# EAGLE design mbV2 (EAGLE 5.10)
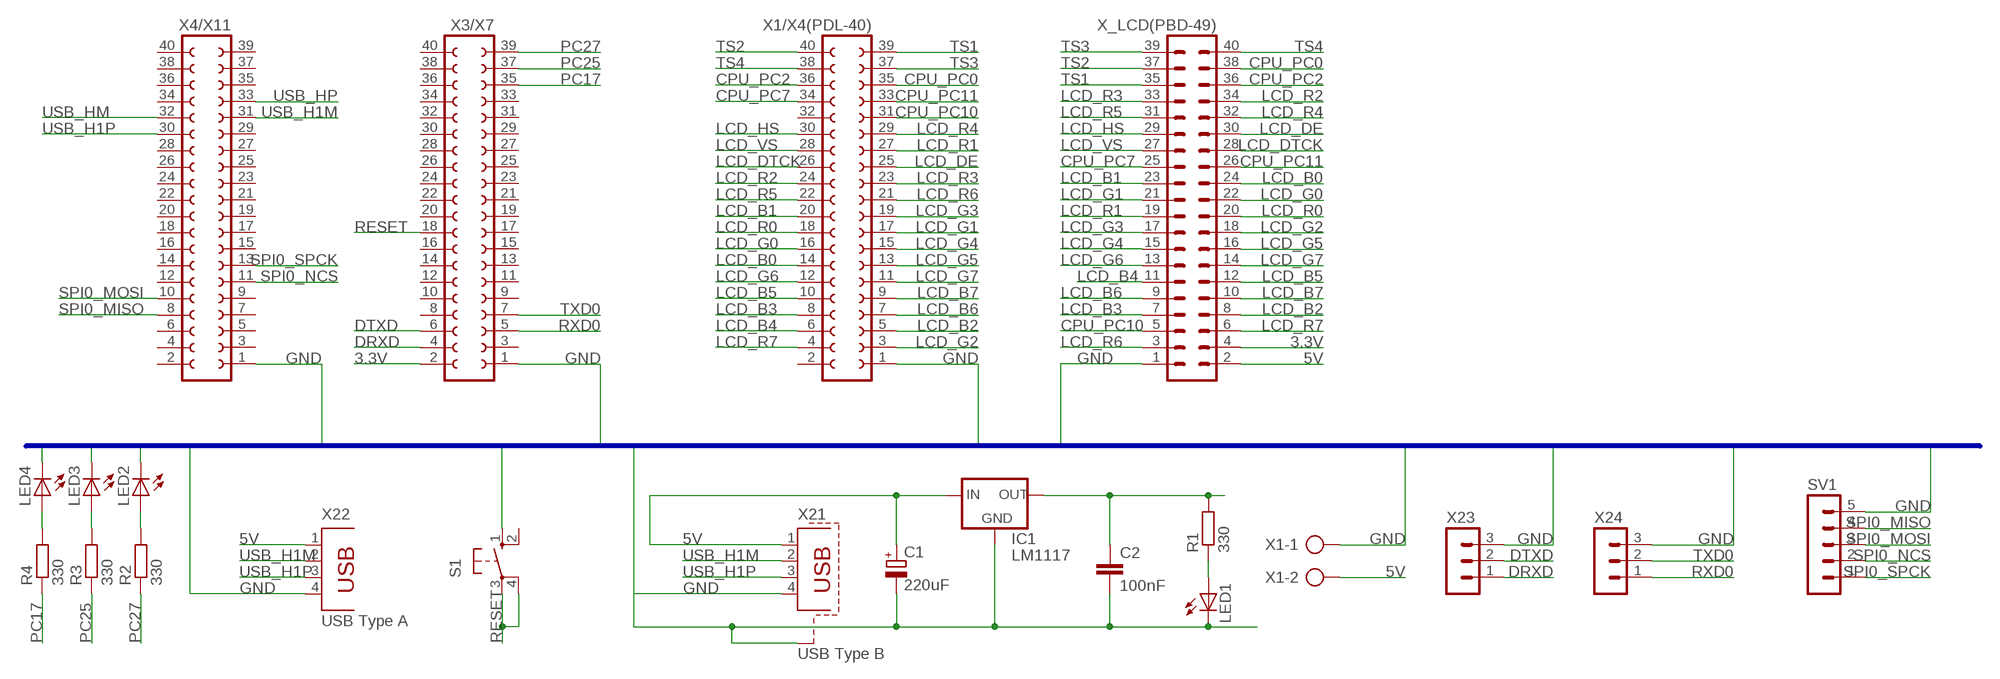
[diagram p0: schematic, sheet 1]

## Parts
C1  220uF  CPOL-EU153CLV-0605  [153CLV-0605]
C2  100nF  C-EUC1206  [C1206]
IC1  LM1117  LM1117TO252  [TO252]
LED1  LEDCHIPLED_1206  [CHIPLED_1206]
LED2  LEDCHIPLED_1206  [CHIPLED_1206]
LED3  LEDCHIPLED_1206  [CHIPLED_1206]
LED4  LEDCHIPLED_1206  [CHIPLED_1206]
R1  330  R-EU_M1206  [M1206]
R2  330  R-EU_M1206  [M1206]
R3  330  R-EU_M1206  [M1206]
R4  330  R-EU_M1206  [M1206]
S1  10-XX  [B3F-10XX]
SV1  MA05-1  [MA05-1]
X1  AK500/2  [AK500/2]
X1/X4(PDL-40)  FE20-2  [FE20-2]
X3/X7  FE20-2  [FE20-2]
X4/X11  FE20-2  [FE20-2]
X21  USB Type B  PN61729-S  [PN61729-S]
X22  USB Type A  PN87520  [PN87520]
X23  MA03-1  [MA03-1]
X24  MA03-1  [MA03-1]
X_LCD(PBD-49)  MA20-2  [MA20-2]

## Nets
3.3V: C2.1 IC1.3(OUT) R1.2 X3/X7.2 X_LCD(PBD-49).4
5V: C1.+ IC1.2(IN) X1.2 X21.1 X22.1 X_LCD(PBD-49).2
CPU_PC0: X1/X4(PDL-40).35 X_LCD(PBD-49).38
CPU_PC2: X1/X4(PDL-40).36 X_LCD(PBD-49).36
CPU_PC7: X1/X4(PDL-40).34 X_LCD(PBD-49).25
CPU_PC10: X1/X4(PDL-40).31 X_LCD(PBD-49).5
CPU_PC11: X1/X4(PDL-40).33 X_LCD(PBD-49).26
DRXD: X3/X7.4 X23.1
DTXD: X3/X7.6 X23.2
GND: C1.- C2.2 IC1.1(GND) LED1.C LED2.C LED3.C LED4.C S1.1(S) SV1.5 X1.1 X1/X4(PDL-40).1 X3/X7.1 X4/X11.1 X21.4 X21.S2 X22.4 X23.3 X24.3 X_LCD(PBD-49).1
LCD_B0: X1/X4(PDL-40).14 X_LCD(PBD-49).24
LCD_B1: X1/X4(PDL-40).20 X_LCD(PBD-49).23
LCD_B2: X1/X4(PDL-40).5 X_LCD(PBD-49).8
LCD_B3: X1/X4(PDL-40).8 X_LCD(PBD-49).7
LCD_B4: X1/X4(PDL-40).6 X_LCD(PBD-49).11
LCD_B5: X1/X4(PDL-40).10 X_LCD(PBD-49).12
LCD_B6: X1/X4(PDL-40).7 X_LCD(PBD-49).9
LCD_B7: X1/X4(PDL-40).9 X_LCD(PBD-49).10
LCD_DE: X1/X4(PDL-40).25 X_LCD(PBD-49).30
LCD_DTCK: X1/X4(PDL-40).26 X_LCD(PBD-49).28
LCD_G0: X1/X4(PDL-40).16 X_LCD(PBD-49).22
LCD_G1: X1/X4(PDL-40).17 X_LCD(PBD-49).21
LCD_G2: X1/X4(PDL-40).3 X_LCD(PBD-49).18
LCD_G3: X1/X4(PDL-40).19 X_LCD(PBD-49).17
LCD_G4: X1/X4(PDL-40).15 X_LCD(PBD-49).15
LCD_G5: X1/X4(PDL-40).13 X_LCD(PBD-49).16
LCD_G6: X1/X4(PDL-40).12 X_LCD(PBD-49).13
LCD_G7: X1/X4(PDL-40).11 X_LCD(PBD-49).14
LCD_HS: X1/X4(PDL-40).30 X_LCD(PBD-49).29
LCD_R0: X1/X4(PDL-40).18 X_LCD(PBD-49).20
LCD_R1: X1/X4(PDL-40).27 X_LCD(PBD-49).19
LCD_R2: X1/X4(PDL-40).24 X_LCD(PBD-49).34
LCD_R3: X1/X4(PDL-40).23 X_LCD(PBD-49).33
LCD_R4: X1/X4(PDL-40).29 X_LCD(PBD-49).32
LCD_R5: X1/X4(PDL-40).22 X_LCD(PBD-49).31
LCD_R6: X1/X4(PDL-40).21 X_LCD(PBD-49).3
LCD_R7: X1/X4(PDL-40).4 X_LCD(PBD-49).6
LCD_VS: X1/X4(PDL-40).28 X_LCD(PBD-49).27
N$1: LED1.A R1.1
N$4: LED2.A R2.2
N$6: LED3.A R3.2
N$7: LED4.A R4.2
PC17: R4.1 X3/X7.35
PC25: R3.1 X3/X7.37
PC27: R2.1 X3/X7.39
RESET: S1.3(P) S1.4(P1) X3/X7.18
RXD0: X3/X7.5 X24.1
SPI0_MISO: SV1.4 X4/X11.8
SPI0_MOSI: SV1.3 X4/X11.10
SPI0_NCS: SV1.2 X4/X11.11
SPI0_SPCK: SV1.1 X4/X11.13
TS1: X1/X4(PDL-40).39 X_LCD(PBD-49).35
TS2: X1/X4(PDL-40).40 X_LCD(PBD-49).37
TS3: X1/X4(PDL-40).37 X_LCD(PBD-49).39
TS4: X1/X4(PDL-40).38 X_LCD(PBD-49).40
TXD0: X3/X7.7 X24.2
USB_H1M: X4/X11.31 X21.2 X22.2
USB_H1P: X4/X11.30 X21.3 X22.3
USB_HM: X4/X11.32
USB_HP: X4/X11.33
Unconnected: S1.2(S1) X1/X4(PDL-40).2 X1/X4(PDL-40).32 X3/X7.3 X3/X7.8 X3/X7.9 X3/X7.10 X3/X7.11 X3/X7.12 X3/X7.13 X3/X7.14 X3/X7.15 X3/X7.16 X3/X7.17 X3/X7.19 X3/X7.20 X3/X7.21 X3/X7.22 X3/X7.23 X3/X7.24 X3/X7.25 X3/X7.26 X3/X7.27 X3/X7.28 X3/X7.29 X3/X7.30 X3/X7.31 X3/X7.32 X3/X7.33 X3/X7.34 X3/X7.36 X3/X7.38 X3/X7.40 X4/X11.2 X4/X11.3 X4/X11.4 X4/X11.5 X4/X11.6 X4/X11.7 X4/X11.9 X4/X11.12 X4/X11.14 X4/X11.15 X4/X11.16 X4/X11.17 X4/X11.18 X4/X11.19 X4/X11.20 X4/X11.21 X4/X11.22 X4/X11.23 X4/X11.24 X4/X11.25 X4/X11.26 X4/X11.27 X4/X11.28 X4/X11.29 X4/X11.34 X4/X11.35 X4/X11.36 X4/X11.37 X4/X11.38 X4/X11.39 X4/X11.40 X21.S1

## Buses
GND

## Library data of the parts
C1 = rcl:CPOL-EU: POLARIZED CAPACITOR, European symbol
C2 = rcl:C-EU: CAPACITOR, European symbol
IC1 = v-reg-2:LM1117
LED1-LED4 = led:LED: LED OSRAM: - CHIPLED LG R971, LG N971, LY N971, LG Q971, LY Q971, LO R971, LY R971 LH N974, LH R974 LS Q976, LO Q976, LY Q976 LO Q996 - Hyper CHIPLED LW Q18S LB Q993, LB Q99A, LB R99A - SideLED LS A670, LO A670, LY A670, LG A670, LP A670 LB A673, LV A673, LT A673, LW A673 LH A674 LY A675 LS A676, LA A676, LO A676, LY A676, LW A676 LS A679, LY A679, LG A679 - Hyper Micro SIDELED® LS Y876, LA Y876, LO Y876, LY Y876 LT Y87S - SmartLED LW L88C, LW L88S LB L89C, LB L89S, LG L890 LS L89K, LO L89K, LY L89K LS L896, LA L896, LO L896, LY L896 - TOPLED LS T670, LO T670, LY T670, LG T670, LP T670 LSG T670, LSP T670, LSY T670, LOP T670, LYG T670 LG T671, LOG T671, LSG T671 LB T673, LV T673, LT T673, LW T673 LH T674 LS T676, LA T676, LO T676, LY T676, LB T676, LH T676, LSB T676, LW T676 LB T67C, LV T67C, LT T67C, LS T67K, LO T67K, LY T67K, LW E67C LS E67B, LA E67B, LO E67B, LY E67B, LB E67C, LV E67C, LT E67C LW T67C LS T679, LY T679, LG T679 LS T770, LO T770, LY T770, LG T770, LP T770 LB T773, LV T773, LT T773, LW T773 LH T774 LS E675, LA E675, LY E675, LS T675 LS T776, LA T776, LO T776, LY T776, LB T776 LHGB T686 LT T68C, LB T68C - Hyper Mini TOPLED® LB M676 - Mini TOPLED Santana® LG M470 LS M47K, LO M47K, LY M47K Source: http://www.osram.convergy.de LUXEON: - LUMILED® LXK2-PW12-R00, LXK2-PW12-S00, LXK2-PW14-U00, LXK2-PW14-V00 LXK2-PM12-R00, LXK2-PM12-S00, LXK2-PM14-U00 LXK2-PE12-Q00, LXK2-PE12-R00, LXK2-PE12-S00, LXK2-PE14-T00, LXK2-PE14-U00 LXK2-PB12-K00, LXK2-PB12-L00, LXK2-PB12-M00, LXK2-PB14-N00, LXK2-PB14-P00, LXK2-PB14-Q00 LXK2-PR12-L00, LXK2-PR12-M00, LXK2-PR14-Q00, LXK2-PR14-R00 LXK2-PD12-Q00, LXK2-PD12-R00, LXK2-PD12-S00 LXK2-PH12-R00, LXK2-PH12-S00 LXK2-PL12-P00, LXK2-PL12-Q00, LXK2-PL12-R00 Source: www.luxeon.com KINGBRIGHT: KA-3528ASYC Source: www.kingbright.com
R1-R4 = resistor:R-EU_: RESISTOR, European symbol
S1 = switch-omron:10-XX: OMRON SWITCH
SV1 = con-lstb:MA05-1: PIN HEADER
X1 = con-ptr500:AK500/2: CONNECTOR
X1/X4(PDL-40) X3/X7 X4/X11 = con-lsta:FE20-2: FEMALE HEADER
X21 = con-berg:PN61729-S: BERG USB connector
X22 = con-berg:PN87520: BERG USB connector
X23 X24 = con-lstb:MA03-1: PIN HEADER
X_LCD(PBD-49) = con-lstb:MA20-2: PIN HEADER

## Board
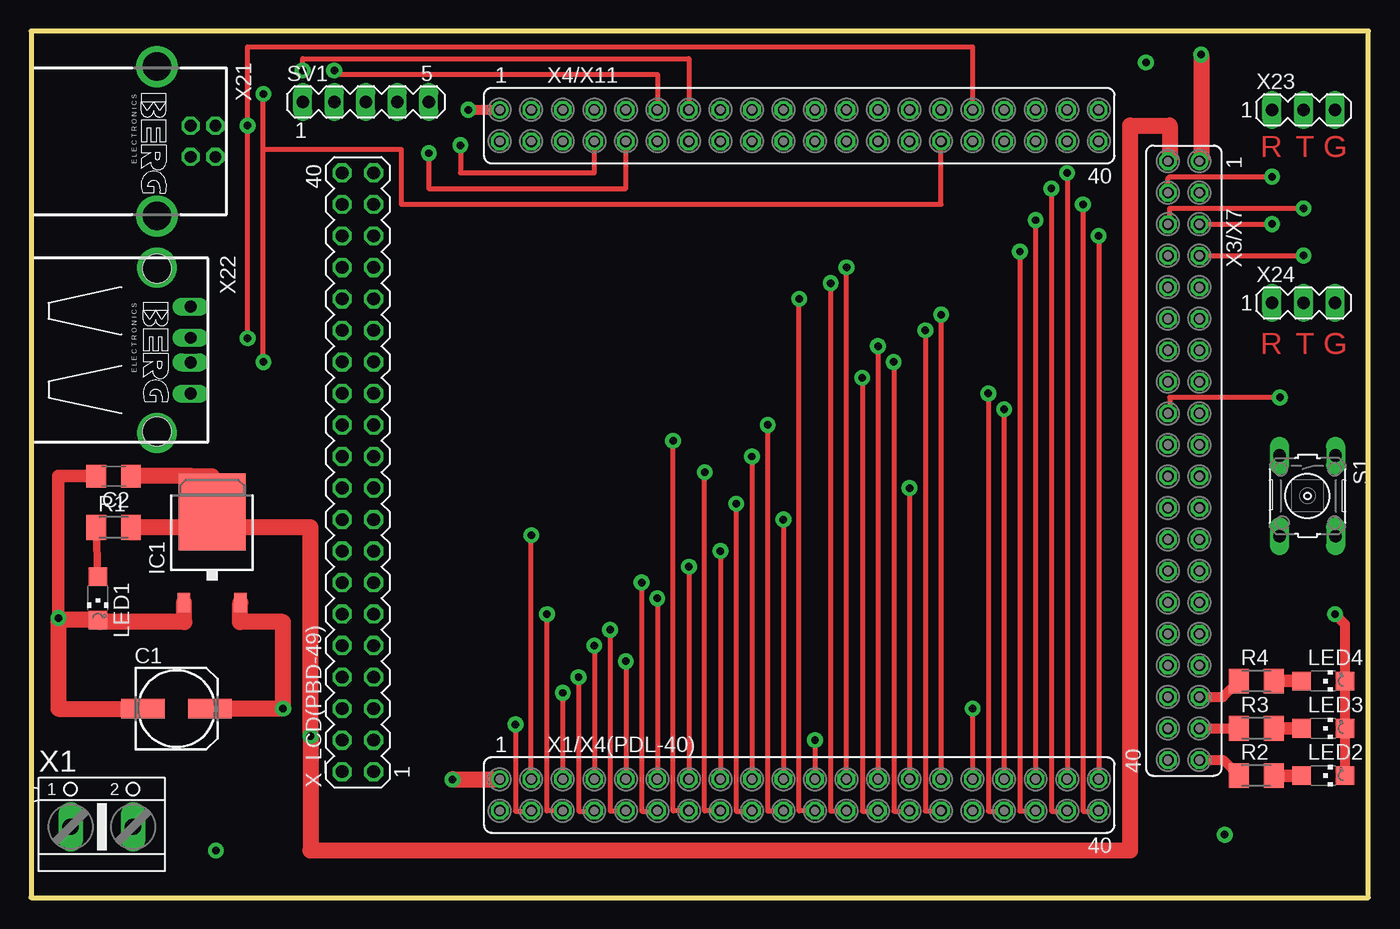
[diagram p1: board, top side]
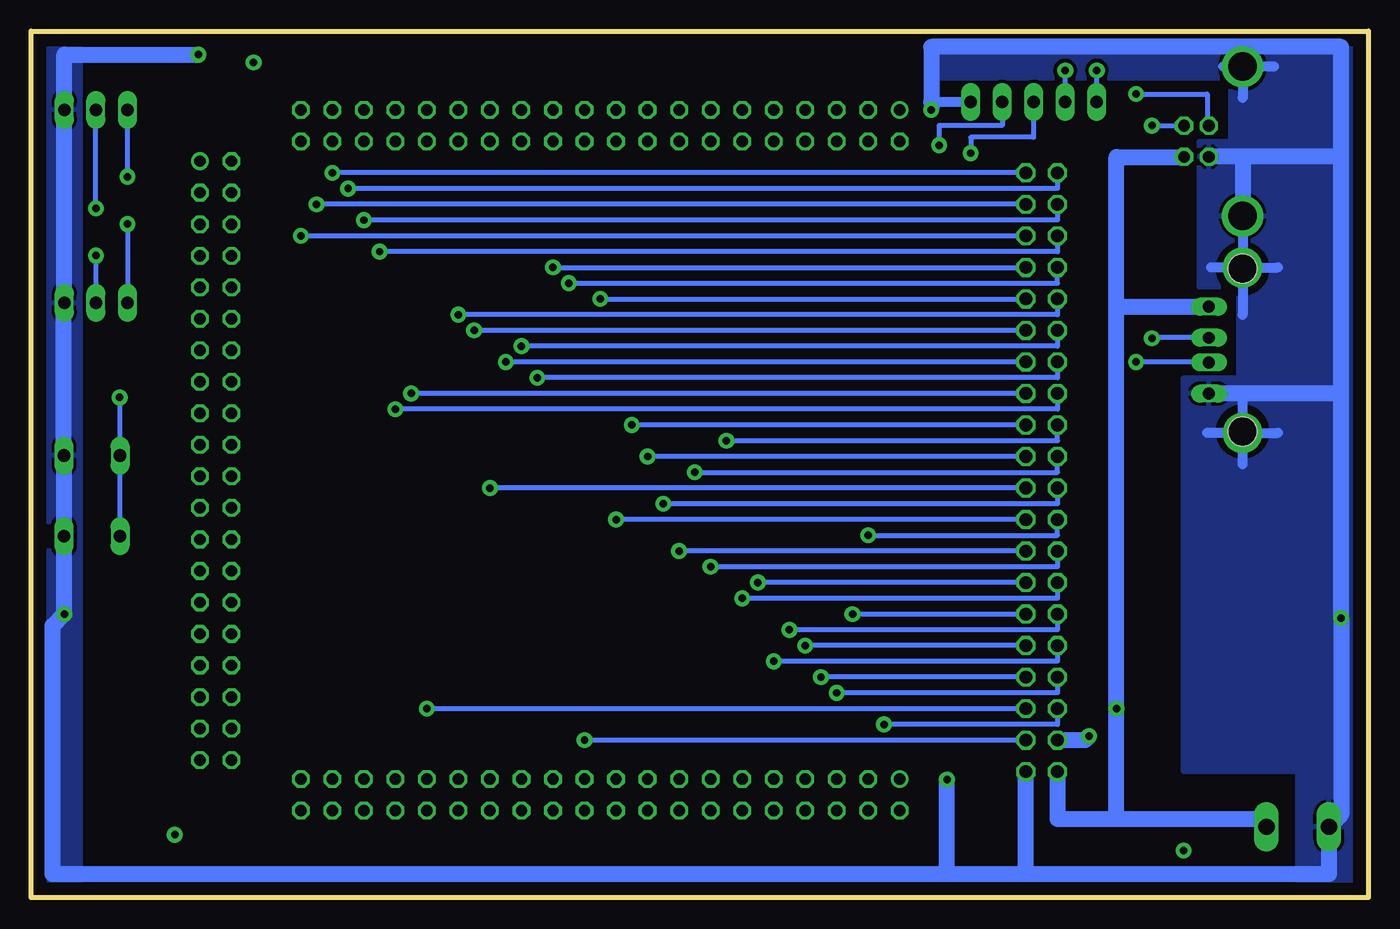
[diagram p2: board, bottom side, seen from below]

Size 107.77 x 69.84 mm. Coordinates in mm from the lower left corner, seen from the top.
Outline: 0,0 107.77,0 107.77,69.84 0,69.84 0,0
Copper layers (1*16): Top 0.035mm / dielectric 1.5mm / Bottom 0.035mm
Design rules "default *": minimum track width 12mil, minimum drill 32mil, track to track 12mil, track to pad 12mil, pad to pad 12mil, via to via 12mil, smd to smd 12mil, copper to edge 40mil, drill to drill 40mil, minimum pad ring 10mil, minimum via ring 8mil, stop-mask expansion 4mil, vias tented up to drill 0mil, thermal gap 10mil

### Footprints (pad centres in the part's own frame; a part is rotated, then mirrored left to right if it is on the bottom)
153CLV-0605 = smd 3.5 x 1.6: + 2.7,0; - -2.7,0
C1206 = smd 1.6 x 1.8: 1 -1.4,0; 2 1.4,0
TO252 = smd 1 x 1.6: 1 -2.28,-6.07; 2 2.28,-6.07 | smd 5.4 x 6.2: 3 0,1.23
CHIPLED_1206 = smd 1.5 x 1.5: A 0,-1.75; C 0,1.75
M1206 = smd 1.6 x 2: 1 -1.4,0; 2 1.4,0
B3F-10XX = drill 1.016 long: 1 -3.251,2.261; 2 3.251,2.261; 3 -3.251,-2.261; 4 3.251,-2.261
MA05-1 = drill 1.016 long: 1 -5.08,0; 2 -2.54,0; 3 0,0; 4 2.54,0; 5 5.08,0
AK500/2 = drill 1.321 long: 1 -2.515,0; 2 2.515,0
FE20-2 = drill 0.914 round: 1 -24.13,1.27 | drill 0.914 octagon: 2 -24.13,-1.27; 3 -21.59,1.27; 4 -21.59,-1.27; 5 -19.05,1.27; 6 -19.05,-1.27; 7 -16.51,1.27; 8 -16.51,-1.27; 9 -13.97,1.27; 10 -13.97,-1.27; 11 -11.43,1.27; 12 -11.43,-1.27; 13 -8.89,1.27; 14 -8.89,-1.27; 15 -6.35,1.27; 16 -6.35,-1.27; 17 -3.81,1.27; 18 -3.81,-1.27; 19 -1.27,1.27; 20 -1.27,-1.27; 21 1.27,1.27; 22 1.27,-1.27; 23 3.81,1.27; 24 3.81,-1.27; 25 6.35,1.27; 26 6.35,-1.27; 27 8.89,1.27; 28 8.89,-1.27; 29 11.43,1.27; 30 11.43,-1.27; 31 13.97,1.27; 32 13.97,-1.27; 33 16.51,1.27; 34 16.51,-1.27; 35 19.05,1.27; 36 19.05,-1.27; 37 21.59,1.27; 38 21.59,-1.27; 39 24.13,1.27; 40 24.13,-1.27
PN61729-S = drill 0.95 octagon: 1 1.25,4.71; 2 -1.25,4.71; 3 -1.25,2.71; 4 1.25,2.71 | drill 2.3 pad 2.9 round: S1 -6.02,0; S2 6.02,0
PN87520 = drill 0.95 long: 1 -3.5,2.71; 2 -1,2.71; 3 1,2.71; 4 3.5,2.71 | hole 2.3: -6.57,0; 6.57,0
MA03-1 = drill 1.016 long: 1 -2.54,0; 2 0,0; 3 2.54,0
MA20-2 = drill 1.016 octagon: 1 -24.13,-1.27; 2 -24.13,1.27; 3 -21.59,-1.27; 4 -21.59,1.27; 5 -19.05,-1.27; 6 -19.05,1.27; 7 -16.51,-1.27; 8 -16.51,1.27; 9 -13.97,-1.27; 10 -13.97,1.27; 11 -11.43,-1.27; 12 -11.43,1.27; 13 -8.89,-1.27; 14 -8.89,1.27; 15 -6.35,-1.27; 16 -6.35,1.27; 17 -3.81,-1.27; 18 -3.81,1.27; 19 -1.27,-1.27; 20 -1.27,1.27; 21 1.27,-1.27; 22 1.27,1.27; 23 3.81,-1.27; 24 3.81,1.27; 25 6.35,-1.27; 26 6.35,1.27; 27 8.89,-1.27; 28 8.89,1.27; 29 11.43,-1.27; 30 11.43,1.27; 31 13.97,-1.27; 32 13.97,1.27; 33 16.51,-1.27; 34 16.51,1.27; 35 19.05,-1.27; 36 19.05,1.27; 37 21.59,-1.27; 38 21.59,1.27; 39 24.13,-1.27; 40 24.13,1.27

### Placement (x,y rotation side)
C1  11.73,15.24 0 top
C2  6.65,33.97 180 top
IC1  14.59,29.84 0 top
LED1  5.38,24.13 180 top
LED2  104.12,9.84 270 top
LED3  104.12,13.65 270 top
LED4  104.12,17.46 270 top
R1  6.65,29.84 0 top
R2  98.73,9.84 0 top
R3  98.73,13.65 0 top
R4  98.73,17.46 0 top
S1  102.86,32.38 270 top
SV1  26.97,64.13 0 top
X1  5.7,5.71 0 top
X1/X4(PDL-40)  61.9,8.29 0 top
X3/X7  92.88,35.23 270 top
X4/X11  61.9,62.23 0 top
X21  10.14,60.96 270 top
X22  10.14,44.13 270 top
X23  102.54,63.5 0 top
X24  102.54,47.94 0 top
X_LCD(PBD-49)  26.34,34.29 90 top

### Tracks (layer width: path | path; a pad name or v marks a point on that pad's centre or on a via)
3.3V  (via drill 0.6 pad 1.27)
  Top 1.016: 13,29.84 13,33.97
  Top 1.27: IC1.3 14.59,33.97 13,33.97 C2.1 | R1.2 13,29.84 22.53,29.84 v22.53,13.02 22.53,3.81 88.57,3.81 88.57,62.23 91.74,62.23 91.74,59.5 X3/X7.2
  Bottom 1.27: X_LCD(PBD-49).4 22.85,12.7 v22.53,13.02
5V  (via drill 0.6 pad 1.27)
  Top 1.27: IC1.2 16.87,22.28 16.81,22.23 20.31,22.23 v20.31,15.24 C1.+
  Bottom 1.27: X_LCD(PBD-49).2 25.07,6.35 20.31,6.35 | 20.31,6.35 8.85,6.35 X1.2 | 20.31,6.35 v20.31,15.24 20.31,47.94 | X22.1 19.99,47.63 20.31,47.94 | 20.31,47.94 20.31,59.69 14.88,59.69 X21.1
CPU_PC0  (via drill 0.6 pad 1.27)
  Top 0.406: v80.95,54.61 X1/X4(PDL-40).35
  Bottom 0.406: X_LCD(PBD-49).38 25.07,54.61 v80.95,54.61
CPU_PC2  (via drill 0.6 pad 1.27)
  Top 0.406: X1/X4(PDL-40).36 79.71,7.02 79.68,6.98 v79.68,52.07
  Bottom 0.406: v79.68,52.07 25.07,52.07 X_LCD(PBD-49).36
CPU_PC7  (via drill 0.6 pad 1.27)
  Top 0.406: v77.14,40.64 77.14,6.98 78.37,6.98 X1/X4(PDL-40).34
  Bottom 0.406: X_LCD(PBD-49).25 v77.14,40.64
CPU_PC10  (via drill 0.6 pad 1.27)
  Top 0.406: X1/X4(PDL-40).31 v75.87,15.24
  Bottom 0.406: X_LCD(PBD-49).5 v75.87,15.24
CPU_PC11  (via drill 0.6 pad 1.27)
  Top 0.406: X1/X4(PDL-40).33 v78.41,39.37
  Bottom 0.406: v78.41,39.37 25.07,39.37 X_LCD(PBD-49).26
DRXD  (via drill 0.6 pad 1.27)
  Top 0.406: X3/X7.4 91.61,57.97 91.74,58.1 v100,58.1
  Bottom 0.406: v100,58.1 X23.1
DTXD  (via drill 0.6 pad 1.27)
  Top 0.406: v102.54,55.56 91.74,55.56 91.74,54.41 X3/X7.6
  Bottom 0.406: v102.54,55.56 X23.2
GND  (via drill 0.6 pad 1.27, 2.2 pad 1.27)
  Top 0.813: LED2.C LED3.C LED4.C 105.88,22.06 v105.08,22.86 | X4/X11.1 v35.23,63.5
  Top 1.016: C2.2 2.21,33.97 v2.21,22.54
  Top 1.27: v94.28,67.94 94.28,59.5 X3/X7.1 | IC1.1 12.31,22.28 12.37,22.23 5.54,22.23 LED1.C 2.37,22.38 v2.21,22.54 2.21,15.24 C1.- | X1/X4(PDL-40).1 33.99,9.56 v33.96,9.52
  Bottom 0.813: 10.14,68.58 10.14,64.45 | 7.6,66.99 11.73,66.99 | v10.14,50.8 7.29,50.8 | v10.14,50.8 12.69,50.8 | 10.14,55.25 v10.14,50.8 | v10.14,50.8 10.14,46.99 | v10.14,37.46 7.29,37.46 | v10.14,37.46 13,37.46 | 10.14,34.92 v10.14,37.46 | v10.14,37.46 10.14,40.01 | v35.23,63.5 35.23,64.13 SV1.5
  Bottom 1.27: 27.61,1.9 3.16,1.9 3.19,1.93 X1.1 2.21,6.69 v2.21,22.54 2.21,40.64 | 27.61,1.9 33.96,1.9 | 33.96,1.9 106.03,1.9 106.03,21.91 v105.08,22.86 105.08,35.6 S1.1 105.12,47.9 X24.3 X23.3 105.08,67.94 v94.28,67.94 | v35.23,63.5 35.23,64.13 35.23,68.58 10.14,68.58 2.21,68.58 2.21,59.37 | 2.21,40.64 2.21,59.37 | 10.14,59.71 2.55,59.71 2.21,59.37 | 10.14,59.71 X21.4 | 10.14,59.71 10.14,55.25 X21.S2 | X22.4 2.21,40.63 2.21,40.64 | 27.61,1.9 X_LCD(PBD-49).1 | 33.96,1.9 v33.96,9.52
  pour Bottom: 35.23,66.04 35.23,69.85 -0.01,69.85 -0.33,69.85 -0.33,0.95 5.7,0.95 5.7,10.16 14.91,10.16 14.91,41.91 10.46,41.91 10.46,48.58 10.46,49.21 13.64,49.21 13.64,60.96 11.1,60.96 11.1,66.04
  pour Bottom: 107.94,0.95 107.94,69.85 103.81,69.85 103.81,0.95
LCD_B0  (via drill 0.6 pad 1.27)
  Top 0.406: X1/X4(PDL-40).14 51.77,7.02 51.74,6.98 v51.74,36.83
  Bottom 0.406: v51.74,36.83 25.07,36.83 X_LCD(PBD-49).24
LCD_B1  (via drill 0.6 pad 1.27)
  Top 0.406: X1/X4(PDL-40).20 59.39,7.02 59.36,6.98 v59.36,38.1
  Bottom 0.406: X_LCD(PBD-49).23 v59.36,38.1
LCD_B2  (via drill 0.6 pad 1.27)
  Top 0.406: X1/X4(PDL-40).5 v42.85,16.51
  Bottom 0.406: v42.85,16.51 25.07,16.51 X_LCD(PBD-49).8
LCD_B3  (via drill 0.6 pad 1.27)
  Top 0.406: v44.12,17.78 44.12,6.98 45.35,6.98 X1/X4(PDL-40).8
  Bottom 0.406: X_LCD(PBD-49).7 v44.12,17.78
LCD_B4  (via drill 0.6 pad 1.27)
  Top 0.406: X1/X4(PDL-40).6 41.61,7.02 41.58,6.98 v41.58,22.86
  Bottom 0.406: v41.58,22.86 X_LCD(PBD-49).11
LCD_B5  (via drill 0.6 pad 1.27)
  Top 0.406: X1/X4(PDL-40).10 46.69,7.02 46.66,6.98 v46.66,21.59
  Bottom 0.406: v46.66,21.59 25.07,21.59 X_LCD(PBD-49).12
LCD_B6  (via drill 0.6 pad 1.27)
  Top 0.406: X1/X4(PDL-40).7 v45.39,20.32
  Bottom 0.406: X_LCD(PBD-49).9 v45.39,20.32
LCD_B7  (via drill 0.6 pad 1.27)
  Top 0.406: v47.93,19.05 X1/X4(PDL-40).9
  Bottom 0.406: X_LCD(PBD-49).10 25.07,19.05 v47.93,19.05
LCD_DE  (via drill 0.6 pad 1.27)
  Top 0.406: X1/X4(PDL-40).25 v68.25,44.45
  Bottom 0.406: v68.25,44.45 25.07,44.45 X_LCD(PBD-49).30
LCD_DTCK  (via drill 0.6 pad 1.27)
  Top 0.406: v66.98,41.91 66.98,6.98 68.21,6.98 X1/X4(PDL-40).26
  Bottom 0.406: X_LCD(PBD-49).28 25.07,41.91 v66.98,41.91
LCD_G0  (via drill 0.6 pad 1.27)
  Top 0.406: X1/X4(PDL-40).16 54.31,7.02 54.28,6.98 v54.28,34.29
  Bottom 0.406: v54.28,34.29 25.07,34.29 X_LCD(PBD-49).22
LCD_G1  (via drill 0.6 pad 1.27)
  Top 0.406: X1/X4(PDL-40).17 v58.09,35.56
  Bottom 0.406: X_LCD(PBD-49).21 v58.09,35.56
LCD_G2  (via drill 0.6 pad 1.27)
  Top 0.406: X1/X4(PDL-40).3 v40.31,29.21
  Bottom 0.406: v40.31,29.21 25.07,29.21 X_LCD(PBD-49).18
LCD_G3  (via drill 0.6 pad 1.27)
  Top 0.406: v60.63,30.48 X1/X4(PDL-40).19
  Bottom 0.406: X_LCD(PBD-49).17 v60.63,30.48
LCD_G4  (via drill 0.6 pad 1.27)
  Top 0.406: v55.55,27.94 X1/X4(PDL-40).15
  Bottom 0.406: X_LCD(PBD-49).15 v55.55,27.94
LCD_G5  (via drill 0.6 pad 1.27)
  Top 0.406: v53.01,26.67 X1/X4(PDL-40).13
  Bottom 0.406: X_LCD(PBD-49).16 25.07,26.67 v53.01,26.67
LCD_G6  (via drill 0.6 pad 1.27)
  Top 0.406: v49.2,25.4 49.2,6.98 50.43,6.98 X1/X4(PDL-40).12
  Bottom 0.406: X_LCD(PBD-49).13 v49.2,25.4
LCD_G7  (via drill 0.6 pad 1.27)
  Top 0.406: X1/X4(PDL-40).11 v50.47,24.13
  Bottom 0.406: v50.47,24.13 25.07,24.13 X_LCD(PBD-49).14
LCD_HS  (via drill 0.6 pad 1.27)
  Top 0.406: X1/X4(PDL-40).30 72.09,7.02 72.06,6.98 v72.06,45.72
  Bottom 0.406: X_LCD(PBD-49).29 v72.06,45.72
LCD_R0  (via drill 0.6 pad 1.27)
  Top 0.406: v56.82,31.75 56.82,6.98 58.05,6.98 X1/X4(PDL-40).18
  Bottom 0.406: X_LCD(PBD-49).20 25.07,31.75 v56.82,31.75
LCD_R1  (via drill 0.6 pad 1.27)
  Top 0.406: v70.79,33.02 X1/X4(PDL-40).27
  Bottom 0.406: X_LCD(PBD-49).19 v70.79,33.02
LCD_R2  (via drill 0.6 pad 1.27)
  Top 0.406: v64.44,49.53 64.44,6.98 65.67,6.98 X1/X4(PDL-40).24
  Bottom 0.406: X_LCD(PBD-49).34 25.07,49.53 v64.44,49.53
LCD_R3  (via drill 0.6 pad 1.27)
  Top 0.406: v65.71,50.8 X1/X4(PDL-40).23
  Bottom 0.406: v65.71,50.8 X_LCD(PBD-49).33
LCD_R4  (via drill 0.6 pad 1.27)
  Top 0.406: v73.33,46.99 X1/X4(PDL-40).29
  Bottom 0.406: X_LCD(PBD-49).32 25.07,46.99 v73.33,46.99
LCD_R5  (via drill 0.6 pad 1.27)
  Top 0.406: X1/X4(PDL-40).22 61.93,7.02 61.9,6.98 v61.9,48.26
  Bottom 0.406: v61.9,48.26 X_LCD(PBD-49).31
LCD_R6  (via drill 0.6 pad 1.27)
  Top 0.406: v63.17,12.7 X1/X4(PDL-40).21
  Bottom 0.406: X_LCD(PBD-49).3 v63.17,12.7
LCD_R7  (via drill 0.6 pad 1.27)
  Top 0.406: v39.04,13.97 39.04,6.98 40.27,6.98 X1/X4(PDL-40).4
  Bottom 0.406: X_LCD(PBD-49).6 25.07,13.97 v39.04,13.97
LCD_VS  (via drill 0.6 pad 1.27)
  Top 0.406: v69.52,43.18 69.52,6.98 70.75,6.98 X1/X4(PDL-40).28
  Bottom 0.406: X_LCD(PBD-49).27 v69.52,43.18
N$1
  Top 0.61: R1.1 LED1.A
N$2  (via drill 0.6 pad 1.27)
  other vias: 89.84,67.31
N$3  (via drill 0.6 pad 1.27)
  other vias: 14.91,3.81
N$4
  Top 1.016: R2.2 LED2.A
N$5  (via drill 0.6 pad 1.27)
  other vias: 96.19,5.08
N$6
  Top 1.016: R3.2 LED3.A
N$7
  Top 1.016: R4.2 LED4.A
PC17
  Top 0.813: X3/X7.35 96.05,16.18 R4.1
PC25
  Top 0.813: X3/X7.37 97.32,13.64 R3.1
PC27
  Top 0.813: X3/X7.39 96.07,11.1 R2.1
RESET  (via drill 0.6 pad 1.27)
  Top 0.406: v100.63,40.32 91.74,40.32 91.74,39.18 X3/X7.18
  Bottom 0.406: S1.4 S1.3 100.59,40.28 v100.63,40.32
RXD0  (via drill 0.6 pad 1.27)
  Top 0.406: X3/X7.5 99.99,54.28 v100,54.29
  Bottom 0.406: v100,54.29 X24.1
SPI0_MISO  (via drill 0.6 pad 1.27)
  Top 0.406: X4/X11.8 45.39,58.42 34.59,58.42 v34.59,60.64
  Bottom 0.406: v34.59,60.64 34.59,62.23 29.51,62.23 SV1.4
SPI0_MOSI  (via drill 0.6 pad 1.27)
  Top 0.406: X4/X11.10 47.93,57.15 32.05,57.15 v32.05,60.01
  Bottom 0.406: v32.05,60.01 32.05,61.28 26.97,61.28 SV1.3
SPI0_NCS  (via drill 0.6 pad 1.27)
  Top 0.406: X4/X11.11 50.47,66.36 24.75,66.36 v24.43,66.67
  Bottom 0.406: SV1.2 v24.43,66.67
SPI0_SPCK  (via drill 0.6 pad 1.27)
  Top 0.406: v21.89,66.67 21.89,67.63 53.01,67.63 X4/X11.13
  Bottom 0.406: SV1.1 v21.89,66.67
TS1  (via drill 0.6 pad 1.27)
  Top 0.406: X1/X4(PDL-40).39 v86.03,53.34
  Bottom 0.406: X_LCD(PBD-49).35 v86.03,53.34
TS2  (via drill 0.6 pad 1.27)
  Top 0.406: v84.76,55.88 84.76,6.98 85.99,6.98 X1/X4(PDL-40).40
  Bottom 0.406: X_LCD(PBD-49).37 v84.76,55.88
TS3  (via drill 0.6 pad 1.27)
  Top 0.406: v83.49,58.42 X1/X4(PDL-40).37
  Bottom 0.406: X_LCD(PBD-49).39 v83.49,58.42
TS4  (via drill 0.6 pad 1.27)
  Top 0.406: v82.22,57.15 82.22,6.98 83.45,6.98 X1/X4(PDL-40).38
  Bottom 0.406: X_LCD(PBD-49).40 25.07,57.15 v82.22,57.15
TXD0  (via drill 0.6 pad 1.27)
  Top 0.406: X3/X7.7 102.52,51.74 v102.54,51.75
  Bottom 0.406: v102.54,51.75 X24.2
USB_H1M  (via drill 0.6 pad 1.27)
  Top 0.406: X4/X11.31 75.87,67.31 75.87,68.58 17.45,68.58 v17.45,62.23 v17.45,45.09
  Bottom 0.406: X21.2 14.88,62.23 v17.45,62.23 | X22.2 17.4,45.13 v17.45,45.09
USB_H1P  (via drill 0.6 pad 1.27)
  Top 0.406: X4/X11.30 73.33,55.88 29.83,55.88 29.83,60.33 18.72,60.33 | v18.72,43.18 18.72,60.33 | 18.72,60.33 v18.72,64.77
  Bottom 0.406: v18.72,64.77 13,64.77 13,62.36 X21.3 | v18.72,43.18 12.9,43.18 X22.3

### Text on the board
Top: R | T | G | R | T | G